# Altium project Relay Controller REV5.PrjPcb
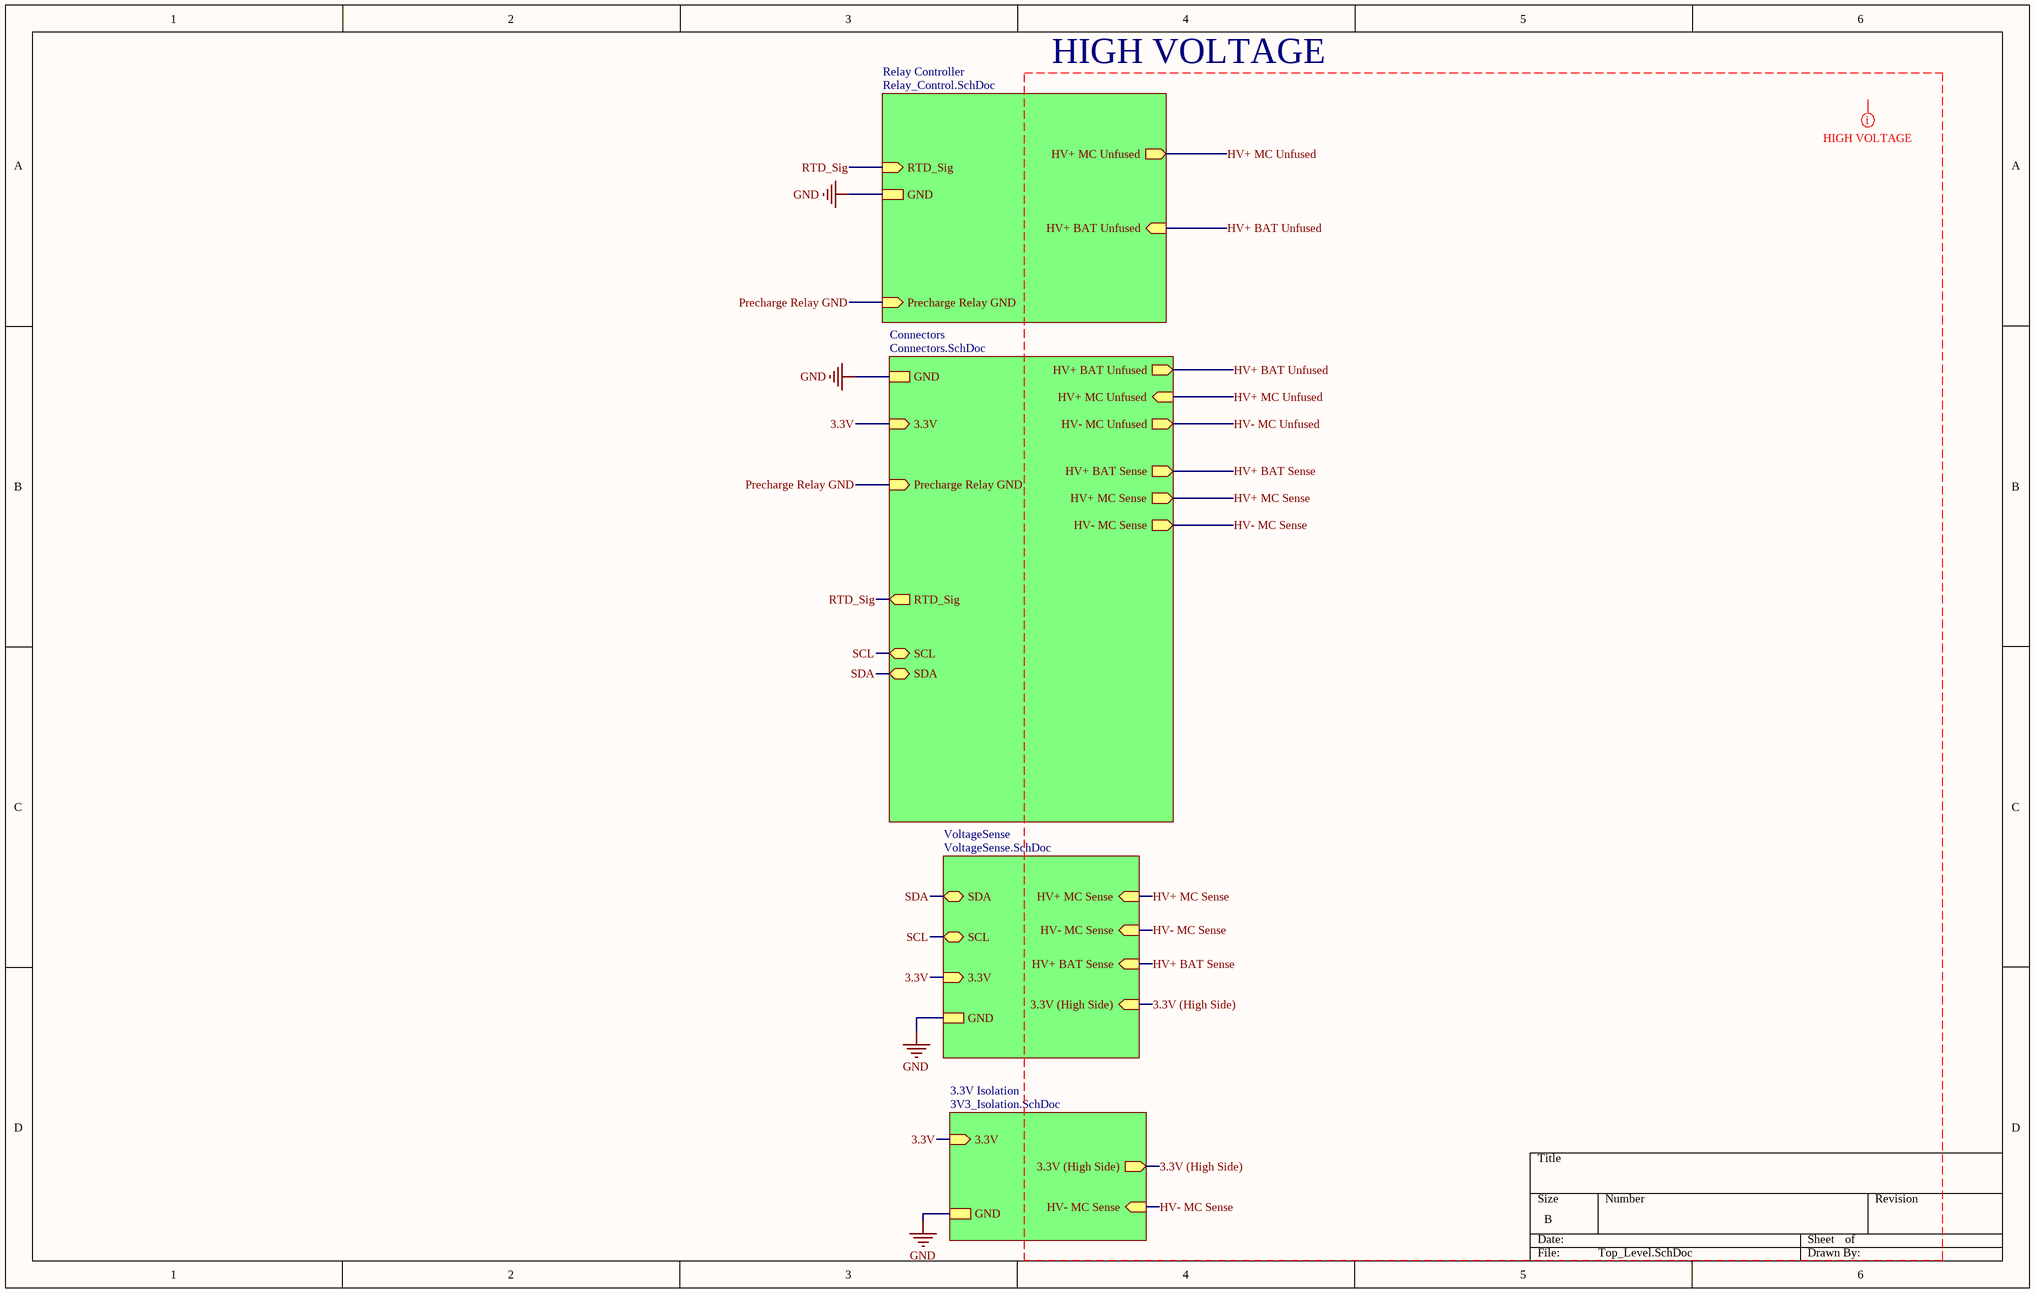
[diagram p0: Top_Level.SchDoc]
5 sheets, 44 parts. Net scope: hierarchical (ports join the sheet entries above them; power ports are global).
Board file: Relay_Controller_REV5.PcbDoc
Sheets:
  Top_Level.SchDoc
    Relay Controller = Relay_Control.SchDoc
    Connectors = Connectors.SchDoc
    VoltageSense = VoltageSense.SchDoc
    3.3V Isolation = 3V3_Isolation.SchDoc

## Sheet Top_Level.SchDoc
size B; SheetNumber: 1; SheetTotal: 10

### Sub-sheets
3.3V Isolation = 3V3_Isolation.SchDoc: GND, 3.3V (in), 3.3V (High Side) (out), HV- MC Sense (in)
Connectors = Connectors.SchDoc: GND, Precharge Relay GND (in), HV+ BAT Unfused (out), HV+ MC Unfused (in), HV- MC Unfused (out), 3.3V (in), RTD_Sig (out), SCL (bidir), SDA (bidir), HV+ BAT Sense (out), HV+ MC Sense (out), HV- MC Sense (out)
Relay Controller = Relay_Control.SchDoc: RTD_Sig (in), GND, Precharge Relay GND (in), HV+ MC Unfused (out), HV+ BAT Unfused (in)
VoltageSense = VoltageSense.SchDoc: HV+ MC Sense (in), HV- MC Sense (in), 3.3V (in), SDA (bidir), SCL (bidir), GND, 3.3V (High Side) (in), HV+ BAT Sense (in)

### Nets
GND: sheet Relay Controller/GND, sheet Connectors/GND, sheet VoltageSense/GND, sheet 3.3V Isolation/GND
3.3V: sheet Connectors/3.3V, sheet VoltageSense/3.3V, sheet 3.3V Isolation/3.3V
3.3V (High Side): sheet VoltageSense/3.3V (High Side), sheet 3.3V Isolation/3.3V (High Side)
HV+ BAT Sense: sheet Connectors/HV+ BAT Sense, sheet VoltageSense/HV+ BAT Sense
HV+ BAT Unfused: sheet Relay Controller/HV+ BAT Unfused, sheet Connectors/HV+ BAT Unfused
HV+ MC Sense: sheet Connectors/HV+ MC Sense, sheet VoltageSense/HV+ MC Sense  [project net HV+ MC]
HV+ MC Unfused: sheet Relay Controller/HV+ MC Unfused, sheet Connectors/HV+ MC Unfused
HV- MC Sense: sheet Connectors/HV- MC Sense, sheet VoltageSense/HV- MC Sense, sheet 3.3V Isolation/HV- MC Sense  [project net HV-]
Precharge Relay GND: sheet Relay Controller/Precharge Relay GND, sheet Connectors/Precharge Relay GND
RTD_Sig: sheet Relay Controller/RTD_Sig, sheet Connectors/RTD_Sig
SCL: sheet Connectors/SCL, sheet VoltageSense/SCL
SDA: sheet Connectors/SDA, sheet VoltageSense/SDA

### Layout directives
mark named HIGH VOLTAGE: 3.3V (High Side), HV+ BAT Sense, HV+ BAT Unfused, HV+ MC Sense, HV+ MC Unfused, HV- MC Sense, HV- MC Unfused

### Notes on the sheet
- HIGH VOLTAGE

## Sheet Relay_Control.SchDoc
size A; SheetNumber: 4; SheetTotal: 10
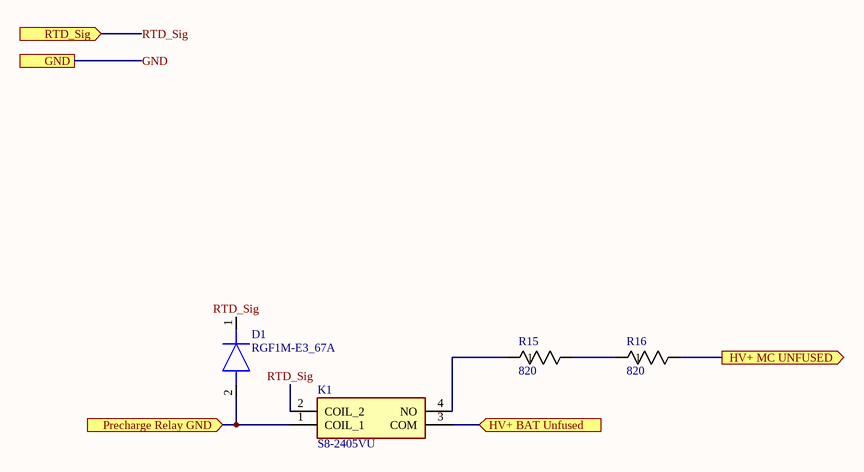
[diagram p1: Relay_Control.SchDoc]

### Parts
D1  RGF1M-E3_67A  [DIOM5426X300N]
K1  S8-2405VU  [S82405VU]
R15  820  [RES_TWM10_OHM]
R16  820  [RES_TWM10_OHM]

### Ports
GND, HV+ BAT Unfused (in), HV+ MC UNFUSED (out), Precharge Relay GND (in), RTD_Sig (in)

### Nets
HV+ BAT Unfused: K1.3(COM) ; port HV+ BAT Unfused
HV+ MC Unfused: R16.2 ; port HV+ MC UNFUSED
Precharge Relay GND: D1.2(A) K1.1(COIL_1) ; port Precharge Relay GND
RTD_Sig: D1.1(K) K1.2(COIL_2) ; port RTD_Sig
NetK1_4: K1.4(NO) R15.1
NetR15_2: R15.2 R16.1

### Library data of the parts
D1 = RGF1M-E3_67A: Diode; Manufacturer_Name: Vishay; Manufacturer_Part_Number: RGF1M-E3/67A; Datasheet Link: https://www.vishay.com/docs/88697/rgf1.pdf; Height: 3mm; Mouser Part Number: 625-RGF1M-E3; Mouser Price/Stock: https://www.mouser.co.uk/ProductDetail/Vishay-General-Semiconductor/RGF1M-E3-67A?qs=4xyK702%2F%252BQ1dl%252BTCdyIThg%3D%3D; Arrow Part Number: RGF1M-E3/67A; Arrow Price/Stock: https://www.arrow.com/en/products/rgf1m-e367a/vishay?region=nac
K1 = S8-2405VU: Relay or Contactor; Manufacturer_Name: Sensata; Datasheet Link: https://componentsearchengine.com/Datasheets/2/S8-2405VU.pdf; Height: 12mm; Manufacturer_Part_Number: S8-2405VU; Mouser Part Number: 285-S8-2405VU; Mouser Price/Stock: https://www.mouser.co.uk/ProductDetail/Cynergy3/S8-2405VU?qs=OlC7AqGiEDkSZm1DfbwcWw%3D%3D
R15 R16 = TWW10J820E: No Description Available; Manufacturer_Name: Ohmite; Copyright: Copyright (C) 2025 Ultra Librarian. All rights reserved.; Manufacturer_Part_Number: TWW10J820E

## Sheet Connectors.SchDoc
size A; SheetNumber: 8; SheetTotal: 10
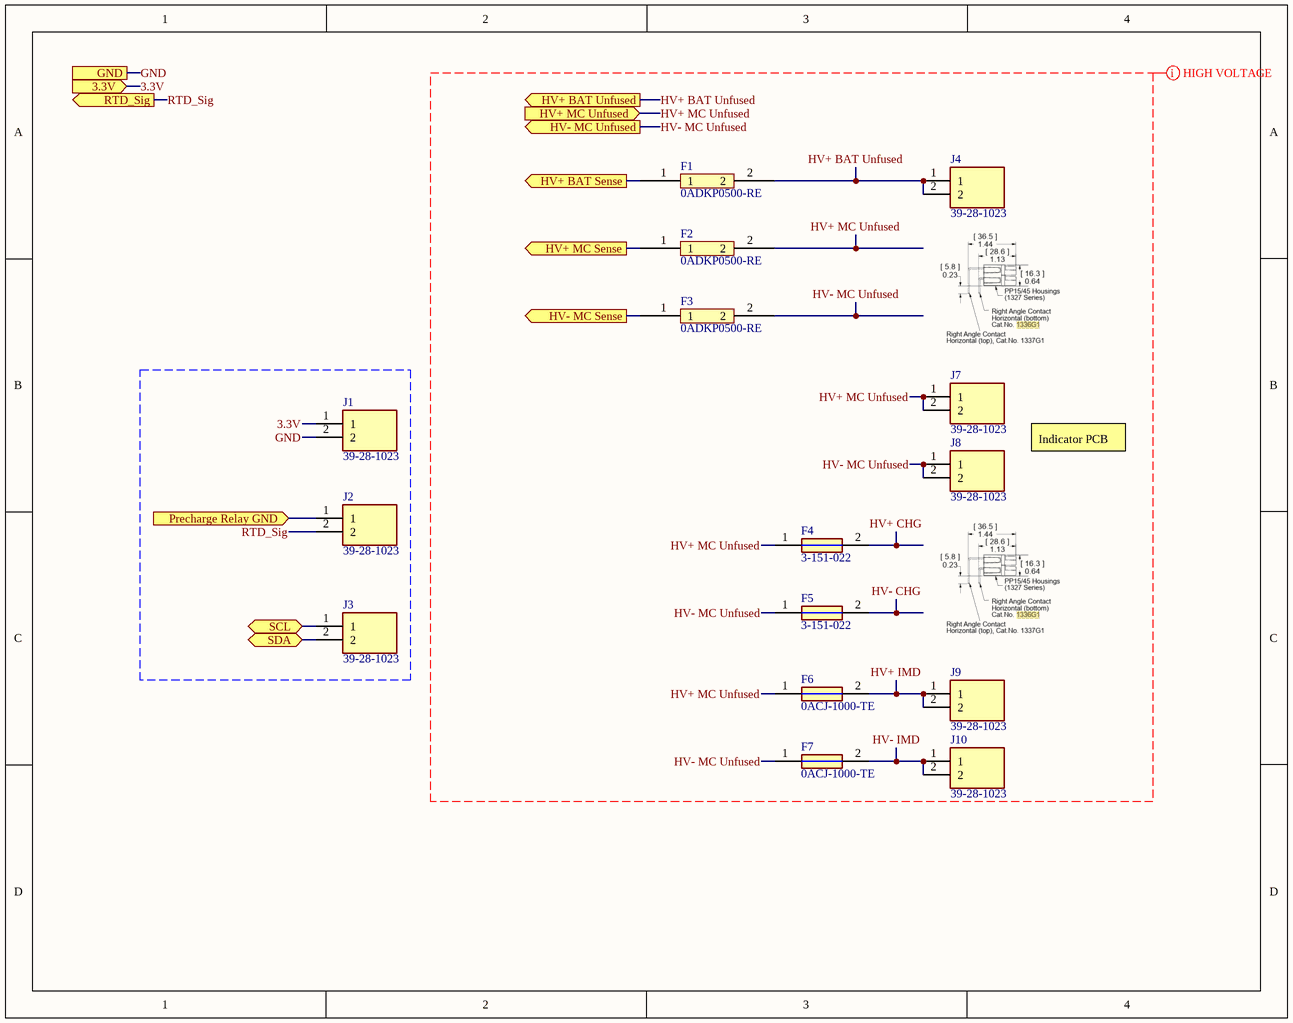
[diagram p2: Connectors.SchDoc]

### Parts
F1  0ADKP0500-RE  [0ADKP0500-RE]
F2  0ADKP0500-RE  [0ADKP0500-RE]
F3  0ADKP0500-RE  [0ADKP0500-RE]
F4  3-151-022  [3151022]
F5  3-151-022  [3151022]
F6  0ACJ-1000-TE  [FUSC13250X555N]
F7  0ACJ-1000-TE  [FUSC13250X555N]
J1  39-28-1023  [39-28-1023]
J2  39-28-1023  [39-28-1023]
J3  39-28-1023  [39-28-1023]
J4  39-28-1023  [39-28-1023]
J7  39-28-1023  [39-28-1023]
J8  39-28-1023  [39-28-1023]
J9  39-28-1023  [39-28-1023]
J10  39-28-1023  [39-28-1023]

### Ports
3.3V (in), GND, HV+ BAT Sense (out), HV+ BAT Unfused (out), HV+ MC Sense (out), HV+ MC Unfused (in), HV- MC Sense (out), HV- MC Unfused (out), Precharge Relay GND (in), RTD_Sig (out), SCL (bidir), SDA (bidir)

### Nets
GND: J1.2 ; port GND
3.3V: J1.1 ; port 3.3V
HV+ BAT Sense: F1.1 ; port HV+ BAT Sense
HV+ BAT Unfused: F1.2 J4.1 J4.2 ; port HV+ BAT Unfused
HV+ CHG: F4.2
HV+ IMD: F6.2 J9.1 J9.2
HV+ MC: F2.1 ; port HV+ MC Sense
HV+ MC Unfused: F2.2 F4.1 F6.1 J7.1 J7.2 ; port HV+ MC Unfused
HV-: F3.1 ; port HV- MC Sense
HV- CHG: F5.2
HV- IMD: F7.2 J10.1 J10.2
HV- MC Unfused: F3.2 F5.1 F7.1 J8.1 J8.2 ; port HV- MC Unfused
Precharge Relay GND: J2.1 ; port Precharge Relay GND
RTD_Sig: J2.2 ; port RTD_Sig
SCL: J3.1 ; port SCL
SDA: J3.2 ; port SDA

### Layout directives
mark named HIGH VOLTAGE: HV+ BAT Unfused, HV+ CHG, HV+ IMD, HV+ MC Unfused, HV- CHG, HV- IMD, HV- MC Unfused

### Notes on the sheet
- Indicator PCB

### Library data of the parts
F1-F3 = 0ADKP0500-RE: Fuse
F4 F5 = 3-151-022: Fuse; Manufacturer_Name: SCHURTER; Datasheet Link: https://www.schurter.com/en/datasheet/AMO_10.3x38; Manufacturer_Part_Number: 3-151-022
F6 F7 = 0ACJ-1000-TE: Fuse; Manufacturer_Name: BelFuse; Datasheet Link: https://www.mouser.de/datasheet/2/643/ds_CP_0ACJ_series-3045709.pdf; Height: 5.55mm; Manufacturer_Part_Number: 0ACJ-1000-TE; Mouser Part Number: 530-0ACJ-1000-TE; Mouser Price/Stock: https://www.mouser.co.uk/ProductDetail/Bel-Fuse/0ACJ-1000-TE?qs=T%252BzbugeAwjiHfega9XRYqg%3D%3D; Arrow Part Number: 0ACJ-1000-TE; Arrow Price/Stock: https://www.arrow.com/en/products/0acj-1000-te/bel-group?utm_currency=USD&region=nac
J1-J4 J7-J10 = 39-28-1023: Connector; Manufacturer_Name: Molex; Datasheet Link: https://www.molex.com/pdm_docs/sd/039281023_sd.pdf; Height: 12.8mm; Manufacturer_Part_Number: 39-28-1023; Mouser Part Number: 538-39-28-1023; Mouser Price/Stock: https://www.mouser.co.uk/ProductDetail/Molex/39-28-1023?qs=LQQHZ4xw2XBykFU0jRHvlQ%3D%3D; Arrow Part Number: 39-28-1023; Arrow Price/Stock: https://www.arrow.com/en/products/39-28-1023/molex?region=nac

## Sheet VoltageSense.SchDoc
size A; SheetNumber: 2; SheetTotal: 10
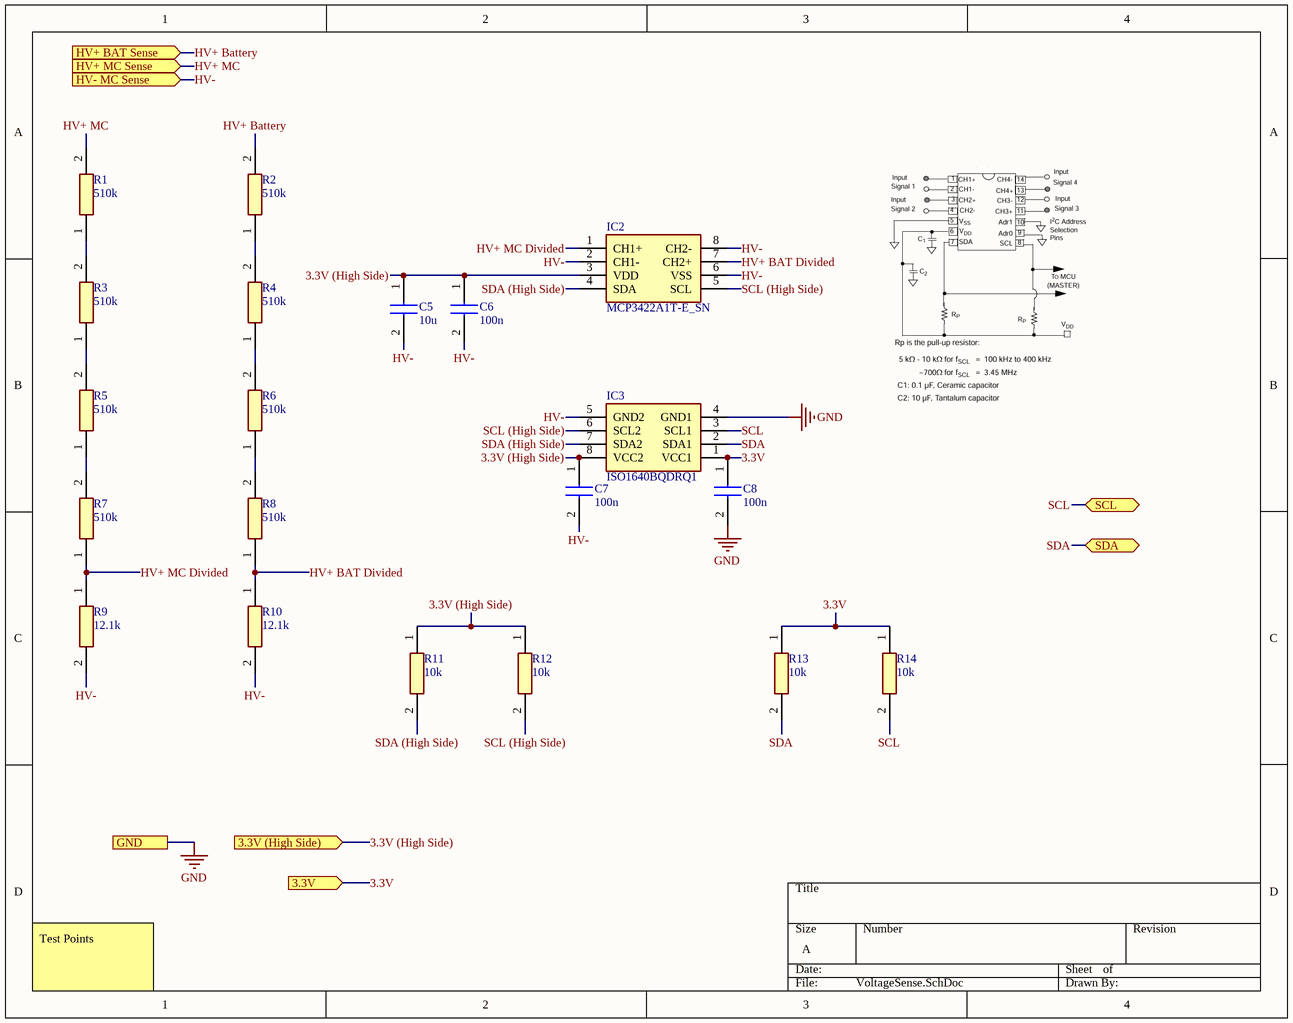
[diagram p3: VoltageSense.SchDoc]

### Parts
C5  10u  [CAPC1608X90N]
C6  100n  [CAPC1608X90N]
C7  100n  [CAPC3216X94N]
C8  100n  [CAPC3216X94N]
IC2  MCP3422A1T-E_SN  [SOIC127P600X175-8N]
IC3  ISO1640BQDRQ1  [SOIC127P600X175-8N]
R1  510k  [RESC3216X75N]
R2  510k  [RESC3216X75N]
R3  510k  [RESC3216X75N]
R4  510k  [RESC3216X75N]
R5  510k  [RESC3216X75N]
R6  510k  [RESC3216X75N]
R7  510k  [RESC3216X75N]
R8  510k  [RESC3216X75N]
R9  12.1k  [ERJS08_U08_(1206)]
R10  12.1k  [ERJS08_U08_(1206)]
R11  10k  [RESC1608X55N]
R12  10k  [RESC1608X55N]
R13  10k  [RESC1608X55N]
R14  10k  [RESC1608X55N]

### Ports
3.3V (High Side) (in), 3.3V (in), GND, HV+ BAT Sense (in), HV+ MC Sense (in), HV- MC Sense (in), SCL (bidir), SDA (bidir)

### Nets
GND: C8.2 IC3.4(GND1) ; port GND
3.3V: C8.1 IC3.1(VCC1) R13.1 R14.1 ; port 3.3V
3.3V (High Side): C5.1 C6.1 C7.1 IC2.3(VDD) IC3.8(VCC2) R11.1 R12.1 ; port 3.3V (High Side)
HV+ BAT Divided: IC2.7(CH2+) R8.1 R10.1
HV+ Battery: R2.2 ; port HV+ BAT Sense  [project net HV+ BAT Sense]
HV+ MC: R1.2 ; port HV+ MC Sense
HV+ MC Divided: IC2.1(CH1+) R7.1 R9.1
HV-: C5.2 C6.2 C7.2 IC2.2(CH1-) IC2.6(VSS) IC2.8(CH2-) IC3.5(GND2) R9.2 R10.2 ; port HV- MC Sense
SCL: IC3.3(SCL1) R14.2 ; port SCL
SCL (High Side): IC2.5(SCL) IC3.6(SCL2) R12.2
SDA: IC3.2(SDA1) R13.2 ; port SDA
SDA (High Side): IC2.4(SDA) IC3.7(SDA2) R11.2
NetR1_1: R1.1 R3.2
NetR2_1: R2.1 R4.2
NetR3_1: R3.1 R5.2
NetR4_1: R4.1 R6.2
NetR5_1: R5.1 R7.2
NetR6_1: R6.1 R8.2

### Notes on the sheet
- Test Points

### Library data of the parts
C5 = CL10A106KQ8NNNL: Capacitor; Manufacturer_Name: SAMSUNG; Datasheet Link: https://product.samsungsem.com/mlcc/basic-search.do?partNumber=CL10A106KQ8NNN; Height: 0.9mm; Manufacturer_Part_Number: CL10A106KQ8NNNL; Mouser Part Number: N/A; Mouser Price/Stock: https://www.mouser.com/Search/Refine.aspx?Keyword=N%2FA; Arrow Part Number: CL10A106KQ8NNNL; Arrow Price/Stock: https://www.arrow.com/en/products/cl10a106kq8nnnl/samsung-electro-mechanics
C6 = 06035C104J4Z2A: Capacitor; Manufacturer_Name: Kyocera AVX; Datasheet Link: https://componentsearchengine.com/Datasheets/1/06031A100FAT2A.pdf; Height: 0.9mm; Manufacturer_Part_Number: 06035C104J4Z2A; Mouser Part Number: 581-06035C104J4Z2A; Mouser Price/Stock: https://www.mouser.co.uk/ProductDetail/KYOCERA-AVX/06035C104J4Z2A?qs=Awwwc1gvTnlncvTGCFZvkw%3D%3D; Arrow Part Number: 06035C104J4Z2A; Arrow Price/Stock: https://www.arrow.com/en/products/06035c104j4z2a/avx
C7 C8 = 12065C104J4Z2A: Capacitor; Manufacturer_Name: Kyocera AVX; Datasheet Link: https://spicat.kyocera-avx.com/product/mlcc/chartview/12065C104J4Z2A/DataSheet/X7R; Height: 0.94mm; Manufacturer_Part_Number: 12065C104J4Z2A; Mouser Part Number: 581-12065C104J4Z2A; Mouser Price/Stock: https://www.mouser.com/Search/Refine.aspx?Keyword=581-12065C104J4Z2A
IC2 = MCP3422A1T-E_SN: Integrated Circuit; Manufacturer_Name: Microchip; Manufacturer_Part_Number: MCP3422A1T-E/SN; Datasheet Link: https://ww1.microchip.com/downloads/en/DeviceDoc/22088c.pdf; Height: 1.75mm; Mouser Part Number: 579-MCP3422A1T-E/SN; Mouser Price/Stock: https://www.mouser.co.uk/ProductDetail/Microchip-Technology/MCP3422A1T-E-SN?qs=X98pPdo4MrvBbe3HwfJ%252Bfw%3D%3D; Arrow Part Number: MCP3422A1T-E/SN; Arrow Price/Stock: https://www.arrow.com/en/products/mcp3422a1t-esn/microchip-technology
IC3 = ISO1640BQDRQ1: Integrated Circuit; Manufacturer_Name: Texas Instruments; Datasheet Link: https://www.ti.com/lit/ds/symlink/iso1640.pdf; Height: 1.75mm; Manufacturer_Part_Number: ISO1640BQDRQ1; Mouser Part Number: 595-ISO1640BQDRQ1; Mouser Price/Stock: https://www.mouser.co.uk/ProductDetail/Texas-Instruments/ISO1640BQDRQ1?qs=QNEnbhJQKvat3Z1mRPODGw%3D%3D; Arrow Part Number: ISO1640BQDRQ1; Arrow Price/Stock: https://www.arrow.com/en/products/iso1640bqdrq1/texas-instruments?region=nac
R1-R8 = CR1206-FX-5103ELF: Resistor; Manufacturer_Name: Bourns; Datasheet Link: http://componentsearchengine.com/Datasheets/1/CR1206-FX-5103ELF.pdf; Height: 0.75mm; Manufacturer_Part_Number: CR1206-FX-5103ELF; Mouser Part Number: 652-CR1206FX-5103ELF; Mouser Price/Stock: https://www.mouser.co.uk/ProductDetail/Bourns/CR1206-FX-5103ELF?qs=O4EQhShwvrpqwloF6Ll%2FVg%3D%3D; Arrow Part Number: CR1206-FX-5103ELF; Arrow Price/Stock: https://www.arrow.com/en/products/cr1206-fx-5103elf/bourns?region=europe
R9 R10 = ERJ-S08F1212V: Resistor; Manufacturer_Name: Panasonic; Datasheet Link: http://industrial.panasonic.com/cdbs/www-data/pdf/RDP0000/AOA0000C334.pdf; Height: 0.7mm; Manufacturer_Part_Number: ERJ-S08F1212V; Mouser Part Number: 667-ERJ-S08F1212V; Mouser Price/Stock: https://www.mouser.co.uk/ProductDetail/Panasonic/ERJ-S08F1212V?qs=Zyl8A9hlmJoa%2FmRL4TNL9g%3D%3D
R11-R14 = CRGCQ0603F10K: Resistor; Manufacturer_Name: TE Connectivity; Datasheet Link: https://www.te.com/commerce/DocumentDelivery/DDEController?Action=showdoc&DocId=Data+Sheet%7F1773204-3%7F1%7Fpdf%7FEnglish%7FENG_DS_1773204-3_1.pdf%7F5-2176339-2; Height: 0.55mm; Manufacturer_Part_Number: CRGCQ0603F10K; Mouser Part Number: 279-CRGCQ0603F10K; Mouser Price/Stock: https://www.mouser.co.uk/ProductDetail/TE-Connectivity-Holsworthy/CRGCQ0603F10K?qs=wUXugUrL1qxhM765MzQWJg%3D%3D; Arrow Part Number: CRGCQ0603F10K; Arrow Price/Stock: https://www.arrow.com/en/products/crgcq0603f10k/te-connectivity?region=nac

## Sheet 3V3_Isolation.SchDoc
size A
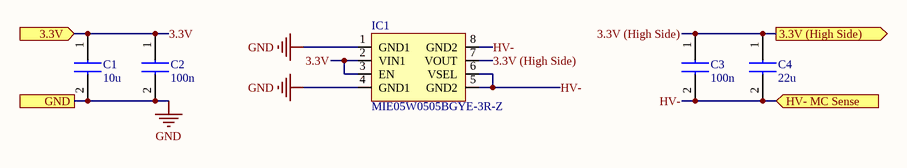
[diagram p4: 3V3_Isolation.SchDoc]

### Parts
C1  10u  [CAPC1608X90N]
C2  100n  [CAPC1608X90N]
C3  100n  [CAPC1608X90N]
C4  22u  [CAPC1608X105N]
IC1  MIE05W0505BGYE-3R-Z  [SOIC127P1030X265-8N]

### Ports
3.3V (High Side) (out), 3.3V (in), GND, HV- MC Sense (in)

### Nets
GND: C1.2 C2.2 IC1.1(GND1) IC1.4(GND1) ; port GND
3.3V: C1.1 C2.1 IC1.2(VIN1) IC1.3(EN) ; port 3.3V
3.3V (High Side): C3.1 C4.1 IC1.7(VOUT) ; port 3.3V (High Side)
HV-: C3.2 C4.2 IC1.5(GND2) IC1.6(VSEL) IC1.8(GND2) ; port HV- MC Sense

### Library data of the parts
C1 = CL10A106KQ8NNNL: Capacitor; Manufacturer_Name: SAMSUNG; Datasheet Link: https://product.samsungsem.com/mlcc/basic-search.do?partNumber=CL10A106KQ8NNN; Height: 0.9mm; Manufacturer_Part_Number: CL10A106KQ8NNNL; Mouser Part Number: N/A; Mouser Price/Stock: https://www.mouser.com/Search/Refine.aspx?Keyword=N%2FA; Arrow Part Number: CL10A106KQ8NNNL; Arrow Price/Stock: https://www.arrow.com/en/products/cl10a106kq8nnnl/samsung-electro-mechanics
C2 C3 = 06035C104J4Z2A: as C6 on sheet VoltageSense; Datasheet Link: https://componentsearchengine.com/Datasheets/1/06031A100FAT2A.pdf; Height: 0.9mm; Manufacturer_Part_Number: 06035C104J4Z2A; Mouser Part Number: 581-06035C104J4Z2A; Mouser Price/Stock: https://www.mouser.co.uk/ProductDetail/KYOCERA-AVX/06035C104J4Z2A?qs=Awwwc1gvTnlncvTGCFZvkw%3D%3D; Arrow Part Number: 06035C104J4Z2A; Arrow Price/Stock: https://www.arrow.com/en/products/06035c104j4z2a/avx
C4 = CL10A226MP8NUNE: Capacitor; Manufacturer_Name: SAMSUNG; Datasheet Link: https://datasheet.datasheetarchive.com/originals/distributors/Datasheets-DGA10/2407063.pdf; Height: 1.05mm; Manufacturer_Part_Number: CL10A226MP8NUNE; Mouser Part Number: 187-CL10A226MP8NUNE; Mouser Price/Stock: https://www.mouser.co.uk/ProductDetail/Samsung-Electro-Mechanics/CL10A226MP8NUNE?qs=gRKWieUq2Hb5O0PTfRKzDQ%3D%3D; Arrow Part Number: CL10A226MP8NUNE; Arrow Price/Stock: https://www.arrow.com/en/products/cl10a226mp8nune/samsung-electro-mechanics?utm_currency=USD&region=europe

## Nets that join several sheets
GND: Connectors (J1.2), VoltageSense (C8.2 IC3.4), 3V3_Isolation (C1.2 C2.2 IC1.1 IC1.4)
3.3V: Connectors (J1.1), VoltageSense (C8.1 IC3.1 R13.1 R14.1), 3V3_Isolation (C1.1 C2.1 IC1.2 IC1.3)
3.3V (High Side): VoltageSense (7 pins), 3V3_Isolation (C3.1 C4.1 IC1.7)
HV+ BAT Sense: Connectors (F1.1), VoltageSense (R2.2)
HV+ BAT Unfused: Relay_Control (K1.3), Connectors (F1.2 J4.1 J4.2)
HV+ MC: Connectors (F2.1), VoltageSense (R1.2)
HV+ MC Unfused: Relay_Control (R16.2), Connectors (5 pins)
HV-: Connectors (F3.1), VoltageSense (9 pins), 3V3_Isolation (5 pins)
Precharge Relay GND: Relay_Control (D1.2 K1.1), Connectors (J2.1)
RTD_Sig: Relay_Control (D1.1 K1.2), Connectors (J2.2)
SCL: Connectors (J3.1), VoltageSense (IC3.3 R14.2)
SDA: Connectors (J3.2), VoltageSense (IC3.2 R13.2)